# Altium project BluetoothPolive.PrjPCB
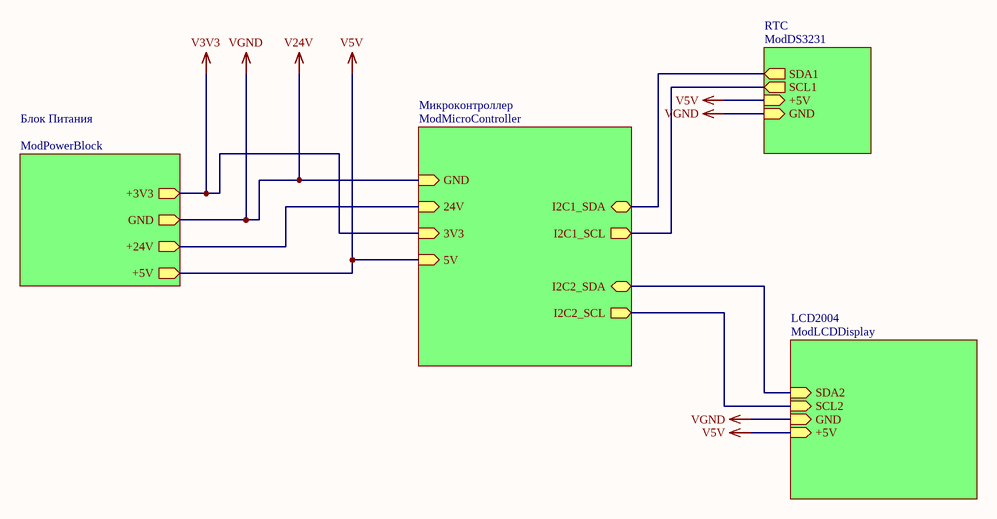
[diagram p0: Main.SchDoc]
5 sheets, 78 parts. Net scope: hierarchical (ports join the sheet entries above them; power ports are global).
Board file: PCBSystemPolive.PcbDoc
Sheets:
  Main.SchDoc
    Микроконтроллер = ModMicroController.SchDoc
    RTC = ModDS3231.SchDoc
    LCD2004 = ModLCDDisplay.SchDoc
    Блок Питания = ModPowerBlock.SchDoc

## Sheet Main.SchDoc
size 420 x 297 mm; Address1: Address1; Address2: Address2; Address3: Address3; Address4: Address4; SheetNumber: 1; Scale: 1:1; Разраб.: Иванов; Обозначение документа: АБВГ.123456.001 Э3; Пров.: Петров; Утв.: Сидоров; Наименование организации: ОАО "Концерн "МПО-Гидроприбор"; Перв. применение: АБВГ.123456.000; Наименование изделия 1: Плата; Наименование изделия 2: Схема электрическая; Наименование изделия 3: принципиальная; Нач. отд.: Нач. отд.; Фамилия нач. отд.: Сидоров

### Sub-sheets
LCD2004 = ModLCDDisplay: SDA2 (in), SCL2 (in), GND (in), +5V (in)
RTC = ModDS3231: SDA1 (out), SCL1 (out), +5V (in), GND (in)
Блок Питания = ModPowerBlock: +3V3 (out), GND (out), +24V (out), +5V (out)
Микроконтроллер = ModMicroController: GND (in), 24V (in), I2C1_SDA, I2C1_SCL (out), 3V3 (in), 5V (in), I2C2_SDA, I2C2_SCL (out)

### Nets
+24V: sheet Микроконтроллер/24V, sheet Блок Питания/+24V
V3V3: sheet Микроконтроллер/3V3, sheet Блок Питания/+3V3  [project net +3V3]
V5V: sheet Микроконтроллер/5V, sheet RTC/+5V, sheet LCD2004/+5V, sheet Блок Питания/+5V  [project net +5V]
V24V: sheet Микроконтроллер/GND, sheet RTC/GND, sheet LCD2004/GND, sheet Блок Питания/GND  [also labelled VGND]  [project net GND]
NetDD1_15: sheet Микроконтроллер/I2C1_SDA, sheet RTC/SDA1
NetDD1_16: sheet Микроконтроллер/I2C1_SCL, sheet RTC/SCL1
NetDD2_14: sheet Микроконтроллер/I2C2_SCL, sheet LCD2004/SCL2
NetDD2_15: sheet Микроконтроллер/I2C2_SDA, sheet LCD2004/SDA2

### Notes on the sheet
- Перв. примен.
- Справ. №
- Подп. и дата
- Инв. № дубл.
- Взам. инв. №
- Разраб.
- Изм.
- Лист
- № докум.
- Подп.
- Дата
- Лит.
- Масса
- Масштаб
- Пров.
- Т.контр.
- Листов
- Инв. № подл.
- Утв.
- Н.контр.
- Копировал
- Формат А3

## Sheet ModMicroController.SchDoc
size 420 x 297 mm; Address1: Address1; Address2: Address2; Address3: Address3; Address4: Address4; SheetNumber: 1; Scale: 1:1; Разраб.: Лепотенко А.С.; Обозначение документа: ЛАС.4367523.002Э3; Перв. применение: ЛАС.4367523.002; Наименование изделия 1: Контроллер управления; Наименование изделия 2: Схема электрическая; Наименование изделия 3: принципиальная; Нач. отд.: Нач. отд.
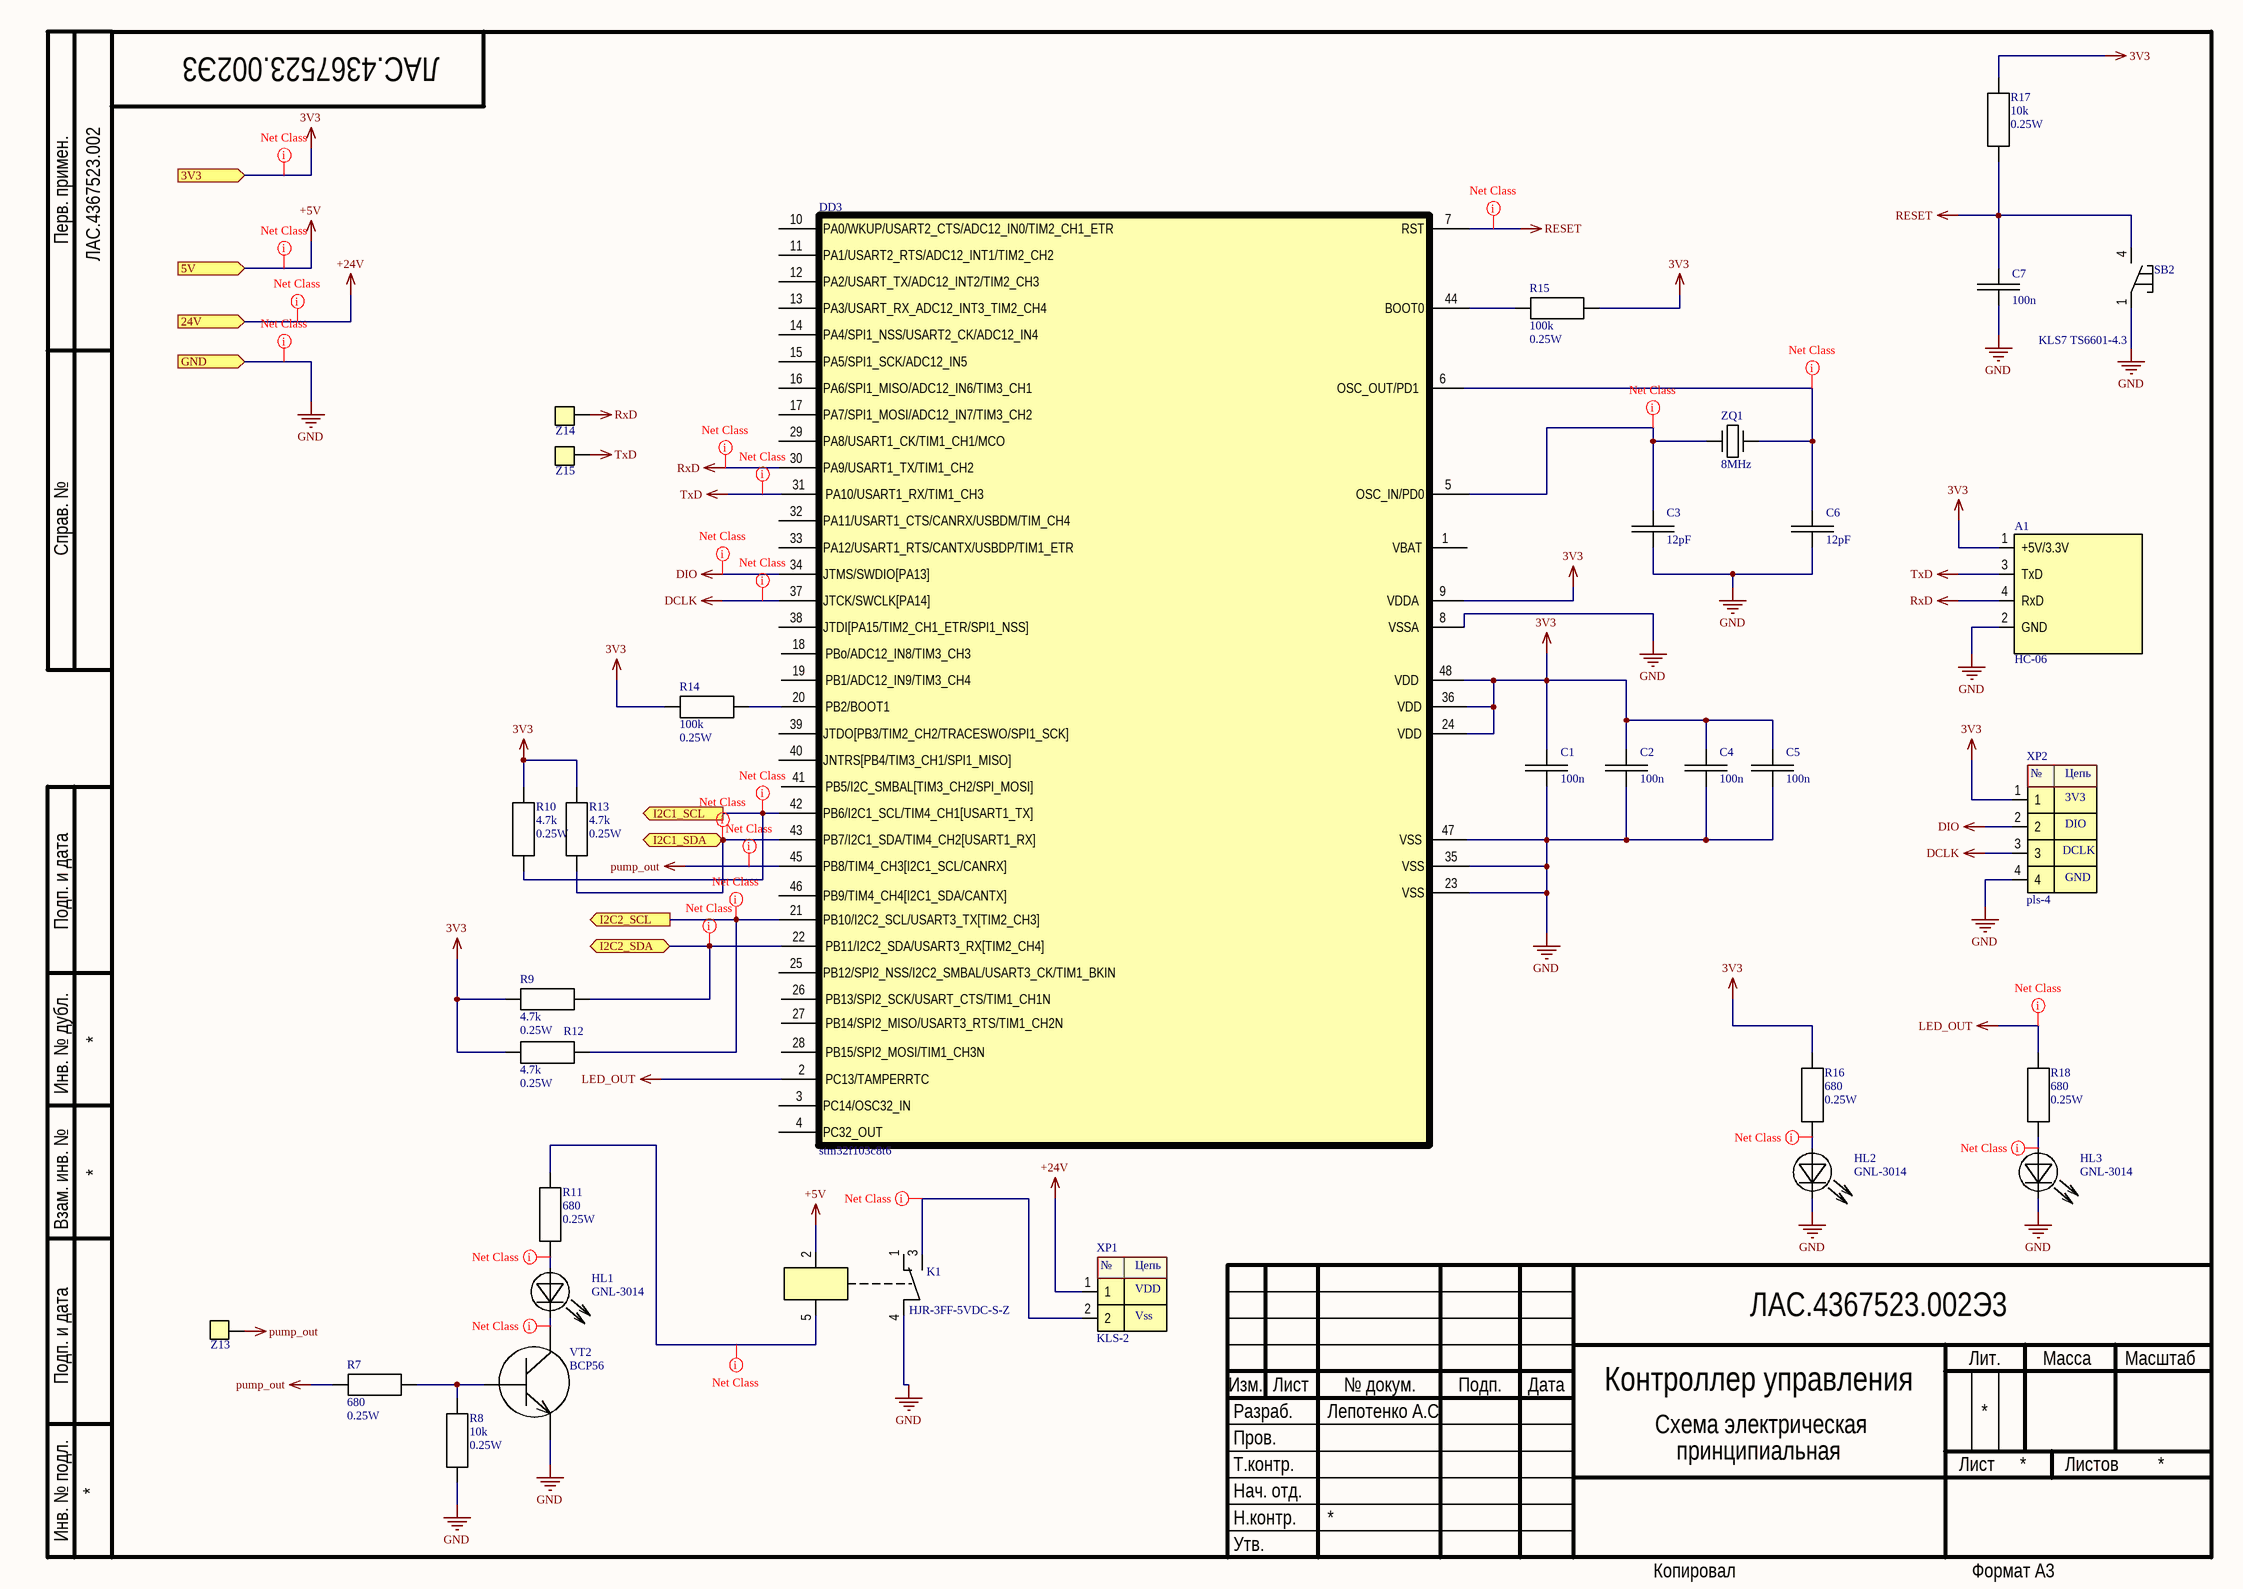
[diagram p1: ModMicroController.SchDoc]

### Parts
A1  HC-06  [HC-06]
C1  100n  [CAP1206]
C2  100n  [CAP1206]
C3  12pF  [CAP1206]
C4  100n  [CAP1206]
C5  100n  [CAP1206]
C6  12pF  [CAP1206]
C7  100n  [CAP1206]
DD3  stm32f103c8t6  [LQFP48]
HL1  GNL-3014  [GNL-3014]
HL2  GNL-3014  [GNL-3014]
HL3  GNL-3014  [GNL-3014]
K1  HJR-3FF-5VDC-S-Z  [HJR-3FF]
R7  Power: 0.25W  [1206]  (hidden comment: 680)
R8  Power: 0.25W  [1206]  (hidden comment: 10k)
R9  value 4.7k  Power: 0.25W  [1206]  (hidden comment: 4k7)
R10  value 4.7k  Power: 0.25W  [1206]  (hidden comment: 4k7)
R11  Power: 0.25W  [1206]  (hidden comment: 680)
R12  value 4.7k  Power: 0.25W  [1206]  (hidden comment: 4k7)
R13  value 4.7k  Power: 0.25W  [1206]  (hidden comment: 4k7)
R14  value 100k  Power: 0.25W  [1206]  (hidden comment: Resistor)
R15  value 100k  Power: 0.25W  [1206]  (hidden comment: Resistor)
R16  Power: 0.25W  [1206]  (hidden comment: 680)
R17  Power: 0.25W  [1206]  (hidden comment: 10k)
R18  Power: 0.25W  [1206]  (hidden comment: 680)
SB2  KLS7 TS6601-4.3  [KLS2]
VT2  BCP56  [SOT223]
XP1  KLS-2  [KLS2-EDR-500-2P]
XP2  pls-4  [Connector_STKLink]
Z13  test Point  [test Point]  (value not drawn)
Z14  test Point  [test Point]  (value not drawn)
Z15  test Point  [test Point]  (value not drawn)
ZQ1  8MHz  [HC-49US]

### Ports
3V3 (in), 5V (in), 24V (in), GND (in), I2C1_SCL (out), I2C1_SDA, I2C2_SCL (out), I2C2_SDA

### Nets
3V3: A1.1(+5V/3.3V) C1.1 C2.1 C4.1 C5.1 DD3.9(VDDA) DD3.24(VDD) DD3.36(VDD) DD3.48(VDD) R9.2 R10.2 R12.2 R13.2 R14.1 R15.2 R16.1 R17.2 XP2.1 ; port 3V3  [project net +3V3]
+5V: K1.2 ; port 5V
+24V: XP1.1 ; port 24V
DCLK: DD3.37(JTCK/SWCLK[PA14]) XP2.3
DIO: DD3.34(JTMS/SWDIO[PA13]) XP2.2
GND: A1.2(GND) C1.2 C2.2 C3.2 C4.2 C5.2 C6.2 C7.2 DD3.8(VSSA) DD3.23(VSS) DD3.35(VSS) DD3.47(VSS) HL2.2 HL3.2 K1.4 R8.1 SB2.1 VT2.3 XP2.4 ; port GND
LED_OUT: DD3.2(PC13/TAMPERRTC) R18.1
pump_out: DD3.45(PB8/TIM4_CH3[I2C1_SCL/CANRX]) R7.2 Z13.1
RESET: C7.1 DD3.7(RST) R17.1 SB2.4
RxD: A1.4(RxD) DD3.30(PA9/USART1_TX/TIM1_CH2) Z14.1
TxD: A1.3(TxD) DD3.31(PA10/USART1_RX/TIM1_CH3) Z15.1
NetC3_1: C3.1 DD3.5(OSC_IN/PD0) ZQ1.1
NetC6_1: C6.1 DD3.6(OSC_OUT/PD1) ZQ1.2
NetDD1_15: DD3.43(PB7/I2C1_SDA/TIM4_CH2[USART1_RX]) R13.1 ; port I2C1_SDA
NetDD1_16: DD3.42(PB6/I2C1_SCL/TIM4_CH1[USART1_TX]) R10.1 ; port I2C1_SCL
NetDD2_14: DD3.21(PB10/I2C2_SCL/USART3_TX[TIM2_CH3]) R12.1 ; port I2C2_SCL
NetDD2_15: DD3.22(PB11/I2C2_SDA/USART3_RX[TIM2_CH4]) R9.1 ; port I2C2_SDA
NetDD3_20: DD3.20(PB2/BOOT1) R14.2
NetDD3_44: DD3.44(BOOT0) R15.1
NetHL1_1: HL1.1 R11.1
NetHL1_2: HL1.2 VT2.2
NetHL2_1: HL2.1 R16.2
NetHL3_1: HL3.1 R18.2
NetK1_3: K1.3 XP1.2
NetK1_5: K1.5 R11.2
NetR7_1: R7.1 R8.2 VT2.1

Not connected (* = marked no-connect by the designer): DD3 1(VBAT) 3(PC14/OSC32_IN) 4(PC32_OUT) 10(PA0/WKUP/USART2_CTS/ADC12_IN0/TIM2_CH1_ETR) 11(PA1/USART2_RTS/ADC12_INT1/TIM2_CH2) 12(PA2/USART_TX/ADC12_INT2/TIM2_CH3) 13(PA3/USART_RX_ADC12_INT3_TIM2_CH4) 14(PA4/SPI1_NSS/USART2_CK/ADC12_IN4) 15(PA5/SPI1_SCK/ADC12_IN5) 16(PA6/SPI1_MISO/ADC12_IN6/TIM3_CH1) 17(PA7/SPI1_MOSI/ADC12_IN7/TIM3_CH2) 18(PBo/ADC12_IN8/TIM3_CH3) 19(PB1/ADC12_IN9/TIM3_CH4) 25(PB12/SPI2_NSS/I2C2_SMBAL/USART3_CK/TIM1_BKIN) 26(PB13/SPI2_SCK/USART_CTS/TIM1_CH1N) 27(PB14/SPI2_MISO/USART3_RTS/TIM1_CH2N) 28(PB15/SPI2_MOSI/TIM1_CH3N) 29(PA8/USART1_CK/TIM1_CH1/MCO) 32(PA11/USART1_CTS/CANRX/USBDM/TIM_CH4) 33(PA12/USART1_RTS/CANTX/USBDP/TIM1_ETR) 38(JTDI[PA15/TIM2_CH1_ETR/SPI1_NSS]) 39(JTDO[PB3/TIM2_CH2/TRACESWO/SPI1_SCK]) 40(JNTRS[PB4/TIM3_CH1/SPI1_MISO]) 41(PB5/I2C_SMBAL[TIM3_CH2/SPI_MOSI]) 46(PB9/TIM4_CH4[I2C1_SDA/CANTX]); K1 1

### Layout directives
net class DigitalNet: DCLK, DIO, LED_OUT, NetC3_1, NetC6_1, NetDD1_15, NetDD1_16, NetDD2_14, NetDD2_15, NetHL3_1, pump_out, RESET, RxD, TxD
net class Power5V_3V3: +3V3, +5V, NetHL1_1, NetHL1_2, NetHL2_1, NetK1_5
net class Power24V: +24V, GND, NetK1_3

### Notes on the sheet
- Перв. примен.
- Справ. №
- Подп. и дата
- Инв. № дубл.
- Взам. инв. №
- Разраб.
- Изм.
- Лист
- № докум.
- Подп.
- Дата
- Лит.
- Масса
- Масштаб
- Пров.
- Т.контр.
- Листов
- Инв. № подл.
- Утв.
- Н.контр.
- Копировал
- Формат А3
- (in symbol Connector_Power) №; Цепь; VDD; Vss
- (in symbol Connector_STKLink) №; Цепь; 3V3; DIO; DCLK; GND

### Library data of the parts
A1 = HC-06: Manufacturer: china; Part Number: HC-06; Price: 5; Quantity: 1; Package: none
C1 C2 C4 C5 = Capasitor: Part Number: CL31B104KBCNNNC; Manufacturer: Samsung; Value: 100nF; Voltage: 50V; Quantity: 20; Package: 1206; Price: 0.035; ShoppingPlace: http://belchip.by/product/?selected_product=31093
C3 C6 = Capasitor: Part Number: 1206120NPO; Manufacturer: Samsung; Voltage: 50V; Value: 12pF; Quantity: 20; Package: 1206; Price: 0,025; ShoppingPlace: http://belchip.by/product/?selected_product=00255
C7 = Capasitor: Value: 100n; Voltage: *; Part Number: *; Quantity: *; Package: *; Price: *; Manufacturer: *; ShoppingPlace: *
DD3 = stm32f103c8t6: Manufacturer: STM; Value: MPU; Part Number: stm32f103c8t6; Price: 4; ShoppingPlace: http://belchip.by/product/?selected_product=10603; Package: LQFP48; Quantity: 1
HL1-HL3 = LED: Part Number: GNL-3014SRD; Manufacturer: G-NOR; Value: RED; Price: 0.04; Package: GNL; Quantity: 6; Shopping Place: http://belchip.by/product/?selected_product=00813
K1 = HJR-3FF-5VDC-S-Z: Manufacturer: TIANBO; Value: 5V; Part Number: HJR-3FF-5VDC-S-Z; Price: 0.6; ShoppingPlace: http://belchip.by/product/?selected_product=00571; Quantity: 1; Package: HJR-3FF
R7 R11 R16 R18 = Resistor: Manufacturer: YAGEO; Part Number: RC1206JR-07680RL; Quntity: 4; Price: 0,15; Package: 1206; ShoppingPlace: http://belchip.by/product/?selected_product=01380; Value: 680
R8 R17 = Resistor: Manufacturer: YAGEO; Part Number: RC1206FR-0710KL; Quntity: 4; Price: 0.15; Package: 1206; ShoppingPlace: http://belchip.by/product/?selected_product=30985; Value: 10k
R9 R10 R12 R13 = Resistor: Manufacturer: YAGEO; Part Number: RC1206JR-074K7L; Quntity: 4; Price: 0,15; Package: 1206; ShoppingPlace: http://belchip.by/product/?selected_product=01399
R14 R15 = Resistor: Manufacturer: YAGEO; Part Number: RC1206JR-07100KL; Quntity: 4; Price: 0,15; Package: 1206; ShoppingPlace: http://belchip.by/product/?selected_product=31131
SB2 = Button: Manufacturer: KLS; Value: 100VDC; Part Number: KLS7 TS6601-4.3; Price: 0,04; ShoppingPlace: http://belchip.by/product/?selected_product=02682; Quantity: 6; Package: KLS2
VT2 = BCP56-16: Manufacturer: NXP Semiconductors; Part Number: BCP56-16; Price: BCP56; ShoppingPlace: http://belchip.by/product/?selected_product=12583; Quantity: 2; Package: SOT223
XP1 = Connector_Power: Part Number: KLS2-EDR; Value: 1000VAC; Package: KLS2; Quantity: 2; Price: 0,13; ShoppingPlace: http://belchip.by/product/?selected_product=03190
XP2 = Connector_STKLink: Part Number: pls-40; Manufacturer: RUICHI; Value: 24VDC; Price: 0,12; Quantity: 2; shoppingPlace: http://belchip.by/product/?selected_product=02009
ZQ1 = Rzanator: Manufacturer: GEYER; Value: 8MHz; Part Number: HC-49US; Package: HC-49US; Quantity: 1; Price: 0,255; ShoppingPlace: http://belchip.by/product/?selected_product=33253

## Sheet ModDS3231.SchDoc
size 420 x 297 mm; Address1: Address1; Address2: Address2; Address3: Address3; Address4: Address4; SheetNumber: 1; Scale: 1:1; Разраб.: Лепотенко А.С.; Обозначение документа: ЛАС.4367523.004Э3; Перв. применение: ЛАС.4367523.004; Наименование изделия 1: Блок часов RTC; Наименование изделия 2: Схема электрическая; Наименование изделия 3: принципиальная; Нач. отд.: Нач. отд.
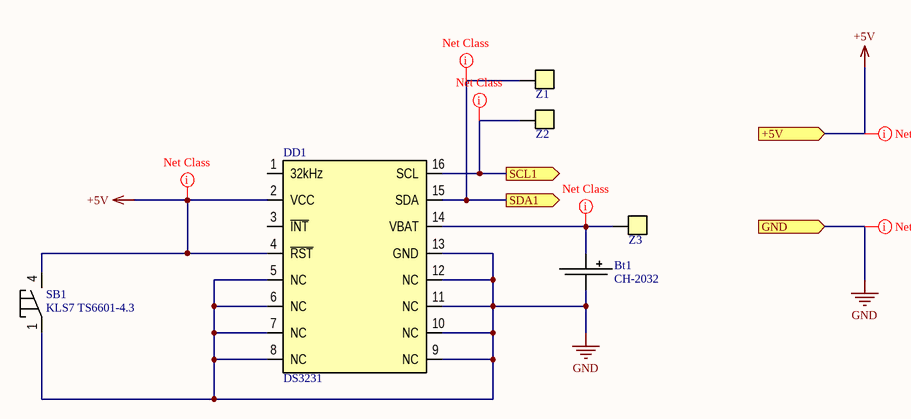
[diagram p2: ModDS3231.SchDoc]

### Parts
Bt1  CH-2032  [CH25-2032]
DD1  DS3231  [SO-16]
SB1  KLS7 TS6601-4.3  [KLS2]
Z1  test Point  [test Point]  (value not drawn)
Z2  test Point  [test Point]  (value not drawn)
Z3  test Point  [test Point]  (value not drawn)

### Ports
+5V (in), GND (in), SCL1 (out), SDA1 (out)

### Nets
+5V: DD1.2(VCC) DD1.4(~{RST}) SB1.4 ; port +5V
GND: Bt1.2 DD1.5(NC) DD1.6(NC) DD1.7(NC) DD1.8(NC) DD1.9(NC) DD1.10(NC) DD1.11(NC) DD1.12(NC) DD1.13(GND) SB1.1 ; port GND
NetBt1_1: Bt1.1 DD1.14(VBAT) Z3.1
NetDD1_15: DD1.15(SDA) Z1.1 ; port SDA1
NetDD1_16: DD1.16(SCL) Z2.1 ; port SCL1

Not connected (* = marked no-connect by the designer): DD1 1(32kHz) 3(~{INT})

### Layout directives
net class Power5V_3V3: +5V, NetBt1_1
net class DigitalNet: NetDD1_15, NetDD1_16
net class Power24V: GND

### Notes on the sheet
- Перв. примен.
- Справ. №
- Подп. и дата
- Инв. № дубл.
- Взам. инв. №
- Разраб.
- Изм.
- Лист
- № докум.
- Подп.
- Дата
- Лит.
- Масса
- Масштаб
- Пров.
- Т.контр.
- Листов
- Инв. № подл.
- Утв.
- Н.контр.
- Копировал
- Формат А3

### Library data of the parts
Bt1 = CR-2032: Manufacturer: Comf; Value: 2032; Quantity: 2; Part Number: CH25-2032; Package: CH25-2032; Price: 0.36; ShoppingPlace: http://belchip.by/product/?selected_product=12241
DD1 = DS3231: Part Number: DS3231SN; Manufacture: Maxim Integrated Products; Value: RTC; Packge: SO-16; Price: 4; Quantity: 1; ShoppingPlace: http://belchip.by/product/?selected_product=06391
SB1 = Button: Manufacturer: KLS; Value: 100VDC; Part Number: KLS7 TS6601-4.3; Price: 0,04; ShoppingPlace: http://belchip.by/product/?selected_product=02682; Quantity: 6; Package: KLS2

## Sheet ModLCDDisplay.SchDoc
size 420 x 297 mm; Address1: Address1; Address2: Address2; Address3: Address3; Address4: Address4; SheetNumber: 1; Scale: 1:1; Разраб.: Лепотенко А.С.; Обозначение документа: ЛАС.4367523.003Э3; Перв. применение: ЛАС.4367523.003; Наименование изделия 1: Блок индикации; Наименование изделия 2: Схема электрическая; Наименование изделия 3: принципиальная; Нач. отд.: Нач. отд.
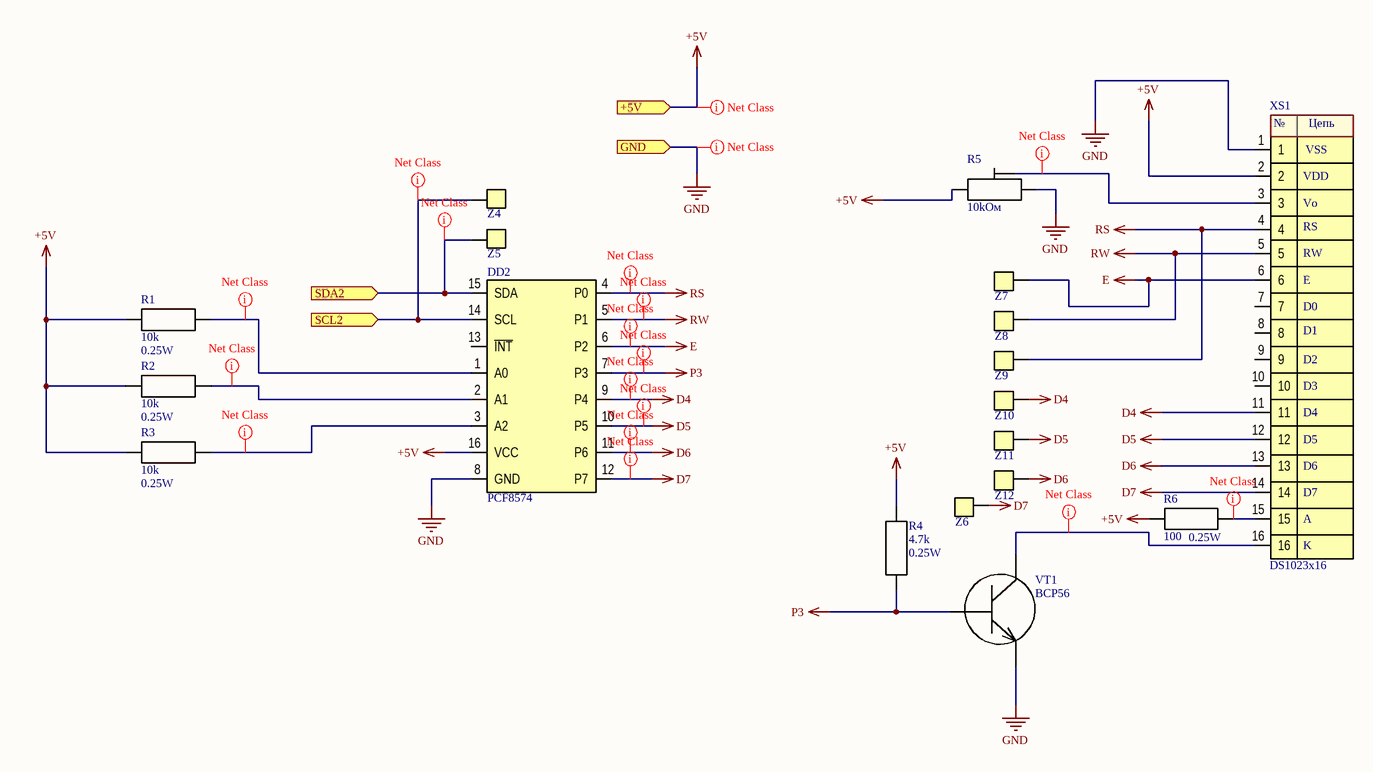
[diagram p3: ModLCDDisplay.SchDoc]

### Parts
DD2  PCF8574  [SO-16]
R1  Power: 0.25W  [1206]  (hidden comment: 10k)
R2  Power: 0.25W  [1206]  (hidden comment: 10k)
R3  Power: 0.25W  [1206]  (hidden comment: 10k)
R4  value 4.7k  Power: 0.25W  [1206]  (hidden comment: 4k7)
R5  10kОм  [3006P]
R6  Power: 0.25W  [1206]  (hidden comment: 100)
VT1  BCP56  [SOT223]
XS1  DS1023x16  [DS1023-2.54x16x1]
Z4  test Point  [test Point]  (value not drawn)
Z5  test Point  [test Point]  (value not drawn)
Z6  test Point  [test Point]  (value not drawn)
Z7  test Point  [test Point]  (value not drawn)
Z8  test Point  [test Point]  (value not drawn)
Z9  test Point  [test Point]  (value not drawn)
Z10  test Point  [test Point]  (value not drawn)
Z11  test Point  [test Point]  (value not drawn)
Z12  test Point  [test Point]  (value not drawn)

### Ports
+5V (in), GND (in), SCL2 (in), SDA2 (in)

### Nets
+5V: DD2.16(VCC) R1.1 R2.1 R3.1 R4.2 R5.1 R6.1 XS1.2 ; port +5V
D4: DD2.9(P4) XS1.11 Z10.1
D5: DD2.10(P5) XS1.12 Z11.1
D6: DD2.11(P6) XS1.13 Z12.1
D7: DD2.12(P7) XS1.14 Z6.1
E: DD2.6(P2) XS1.6 Z7.1
GND: DD2.8(GND) R5.3 VT1.3 XS1.1 ; port GND
P3: DD2.7(P3) R4.1 VT1.1
RS: DD2.4(P0) XS1.4 Z9.1
RW: DD2.5(P1) XS1.5 Z8.1
NetDD2_1: DD2.1(A0) R1.2
NetDD2_2: DD2.2(A1) R2.2
NetDD2_3: DD2.3(A2) R3.2
NetDD2_14: DD2.14(SCL) Z4.1 ; port SCL2
NetDD2_15: DD2.15(SDA) Z5.1 ; port SDA2
NetR5_2: R5.2 XS1.3
NetR6_2: R6.2 XS1.15
NetVT1_2: VT1.2 XS1.16

Not connected (* = marked no-connect by the designer): DD2 13(~{INT}); XS1 7 8 9 10

### Layout directives
net class DigitalNet: D4, D5, D6, D7, E, NetDD2_14, NetDD2_15, P3, RS, RW
net class Power5V_3V3: +5V, NetDD2_1, NetDD2_2, NetDD2_3, NetR5_2, NetR6_2, NetVT1_2
net class Power24V: GND

### Notes on the sheet
- Перв. примен.
- Справ. №
- Подп. и дата
- Инв. № дубл.
- Взам. инв. №
- Разраб.
- Изм.
- Лист
- № докум.
- Подп.
- Дата
- Лит.
- Масса
- Масштаб
- Пров.
- Т.контр.
- Листов
- Инв. № подл.
- Утв.
- Н.контр.
- Копировал
- Формат А3
- (in symbol DS1023x2.54x16x1) №; Цепь; VSS; VDD; Vo; RS; RW; E; D0; D1; D2; D3; D4; D5; D6; D7; A; K

### Library data of the parts
DD2 = PCF8574: part Number: PCF8574DW; Manufacturer: Texas Instruments; Value: IC; Package: SO-16; Price: 1.585; ShoppingPlace: http://belchip.by/product/?selected_product=29967; Quantity: 3
R1-R3 = Resistor: as R8 on sheet ModMicroController; Price: 0.15; Package: 1206; ShoppingPlace: http://belchip.by/product/?selected_product=30985; Value: 10k
R4 = Resistor: as R9 on sheet ModMicroController; Price: 0,15; Package: 1206; ShoppingPlace: http://belchip.by/product/?selected_product=01399
R5 = POT: Part Number: 3006-103-Z-LF; Manufacturer: Bours; Power: 0,125W; Package: 3006; Price: 0,445; ShoppingPlace: http://belchip.by/product/?selected_product=32831; Value: 10kОм; Quantity: 1
R6 = Resistor: Manufacturer: YAGEO; Part Number: RC1206FR-07100RL; Quntity: 4; Price: 0.15; Package: 1206; ShoppingPlace: http://belchip.by/product/?selected_product=18520; Value: 100
VT1 = BCP56-16: Manufacturer: NXP Semiconductors; Part Number: BCP56-16; Price: BCP56; ShoppingPlace: http://belchip.by/product/?selected_product=12583; Quantity: 2; Package: SOT223
XS1 = DS1023x2.54x16x1: Manufacturer: Ningbo connfly electronic; Part Number: DS1023-1*16S21; Value: 500VDC; Package: DS1023; Price: 0.12; ShoppingPlace: https://www.ru-chipdip.by/product/pbs16; Quantity: 4

## Sheet ModPowerBlock.SchDoc
size 420 x 297 mm; Address1: Address1; Address2: Address2; Address3: Address3; Address4: Address4; SheetNumber: 1; Scale: 1:1; Разраб.: Лепотенко А.С.; Обозначение документа: ЛАС.4367523.001Э3; Перв. применение: ЛАС.4367523.001; Наименование изделия 1: DC-DC преобразователь; Наименование изделия 2: Схема электрическая; Наименование изделия 3: принципиальная; Нач. отд.: Нач. отд.
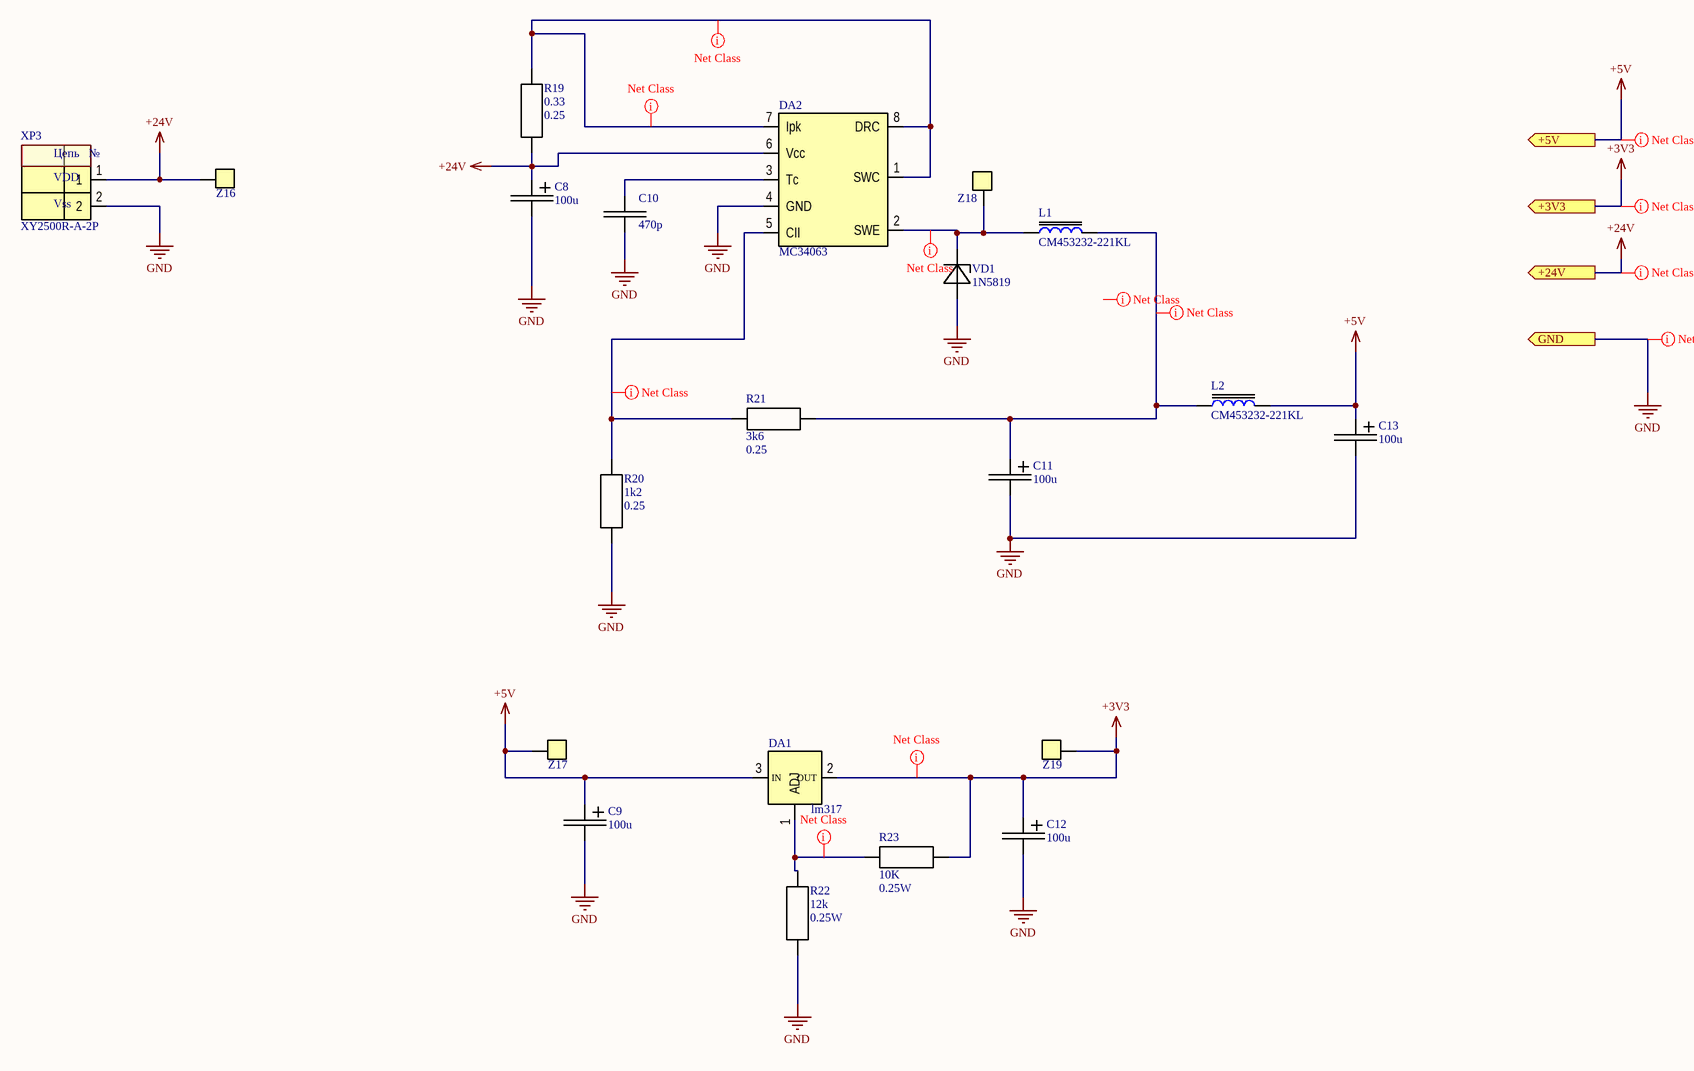
[diagram p4: ModPowerBlock.SchDoc]

### Parts
C8  100u  [CAPAE120103X105MTypeG]
C9  100u  [CAPAE120103X105MTypeG]
C10  470p  [CAP1206]
C11  100u  [CAPAE120103X105MTypeG]
C12  100u  [CAPAE120103X105MTypeG]
C13  100u  [CAPAE120103X105MTypeG]
DA1  lm317  [SOD-223]
DA2  MC34063  [SO-8]
L1  CM453232-221KL  [453232]
L2  CM453232-221KL  [453232]
R19  Power: 0.25  [1206]  (hidden comment: 0.33)
R20  Power: 0.25  [1206]  (hidden comment: 1k2)
R21  Power: 0.25  [1206]  (hidden comment: 3k6)
R22  Power: 0.25W  [1206]  (hidden comment: 12k)
R23  Power: 0.25W  [1206]  (hidden comment: 10k)
VD1  1N5819  [SOD-123]
XP3  XY2500R-A-2P  [KLS2-EDR-500-2P]
Z16  test Point  [test Point]  (value not drawn)
Z17  test Point  [test Point]  (value not drawn)
Z18  test Point  [test Point]  (value not drawn)
Z19  test Point  [test Point]  (value not drawn)

### Ports
+3V3 (out), +5V (out), +24V (out), GND (out)

### Nets
+3V3: C12.1 DA1.2(OUT) R23.2 Z19.1 ; port +3V3
+5V: C9.1 C13.1 DA1.3(IN) L2.2 Z17.1 ; port +5V
+24V: C8.1 DA2.6(Vcc) R19.1 XP3.1 Z16.1 ; port +24V
GND: C8.2 C9.2 C10.2 C11.2 C12.2 C13.2 DA2.4(GND) R20.2 R22.2 VD1.1 XP3.2 ; port GND
NetC10_1: C10.1 DA2.3(Tc)
NetC11_1: C11.1 L1.2 L2.1 R21.2
NetDA1_1: DA1.1(ADJ) R22.1 R23.1
NetDA2_1: DA2.1(SWC) DA2.7(Ipk) DA2.8(DRC) R19.2
NetDA2_2: DA2.2(SWE) L1.1 VD1.2 Z18.1
NetDA2_5: DA2.5(CII) R20.1 R21.1

### Layout directives
net class Power5V_3V3: (no net found under the mark), +3V3, +5V, NetC11_1, NetDA1_1, NetDA2_2, NetDA2_5
net class Power24V: +24V, GND, NetDA2_1

### Notes on the sheet
- Перв. примен.
- Справ. №
- Подп. и дата
- Инв. № дубл.
- Взам. инв. №
- Разраб.
- Изм.
- Лист
- № докум.
- Подп.
- Дата
- Лит.
- Масса
- Масштаб
- Пров.
- Т.контр.
- Листов
- Инв. № подл.
- Утв.
- Н.контр.
- Копировал
- Формат А3
- (in symbol Connector_Power) Цепь; №; VDD; Vss

### Library data of the parts
C8 C9 C11-C13 = Capasitor Electrolit: Part Namber: RC1H107M08010VR; Manufacturer: Samwha; Value: 100uF; Power: 50V; Price: 0.23; ShoppingPlace: http://belchip.by/product/?selected_product=12709; Package: TypeG
C10 = Capasitor: Part Number: 1206471X7R; Manufacturer: FAITHFULL LINK; Voltage: 50V; Value: 470p; Quantity: 4; Package: 1206; Price: 0.02; ShoppingPlace: http://belchip.by/product/?selected_product=00281
DA1 = lm317: Manufacturer: Texas Instruments; Part Number: LM317AEMP/NOPB; Value: 1.5A; Package: SOT-223; Quantity: 1; Price: 2.5; ShoppingPlace: http://belchip.by/product/?selected_product=11445
DA2 = MC34063: part Number: MC34063ADR; Manufacturer: ON Semiconductor; Value: *; Package: SO-8; Price: 0,3; ShoppingPlace: http://belchip.by/product/?selected_product=28823; Quantity: 4
L1 L2 = CM453232-221KL: Manufacturer: Bourns; Value: 220u; Part Number: CM453232-221KL; ShoppingPlace: https://www.ru-chipdip.by/product/cm453232-221kl; Price: 0.225; Package: 1812; Quantity: 2
R19 = Resistor: Manufacturer: Royal Ohm; Part Number: 1206R033; Quntity: 3; Price: 0.5; Package: 1206; ShoppingPlace: http://belchip.by/product/?selected_product=32979; Value: 0.33
R20 = Resistor: Manufacturer: Royal Ohm; Part Number: 1206R122; Quntity: 3; Price: 0.5; Package: 1206; ShoppingPlace: http://belchip.by/product/?selected_product=01386; Value: 1k2
R21 = Resistor: Manufacturer: Royal Ohm; Part Number: 1206R362; Quntity: 3; Price: 0.5; Package: 1206; ShoppingPlace: http://belchip.by/product/?selected_product=01396; Value: 3k6
R22 R23 = Resistor: Manufacturer: YAGEO; Part Number: RC1206FR-0710KL; Quntity: 3; Price: 0.15; Package: 1206
  R22: ShoppingPlace: http://belchip.by/product/?selected_product=01409; Value: 12k
  R23: ShoppingPlace: http://belchip.by/product/?selected_product=30985; Value: 10K
VD1 = 1N5819: Manufacturer: GALAXY; Value: 40V; Power: 1A; Price: 0.12; ShoppingPlace: http://belchip.by/product/?selected_product=08853; Package: SOD-123; Quantity: 3
XP3 = Connector_Power: Value: 500VDC; Package: XY2500R; Part Number: XY2500R-A-2P; Quantity: 1; Price: 0,10; ShoppingPlace: http://belchip.by/product/?selected_product=14514

## Nets that join several sheets
+3V3: ModMicroController (18 pins), ModPowerBlock (C12.1 DA1.2 R23.2 Z19.1)
+5V: ModMicroController (K1.2), ModDS3231 (DD1.2 DD1.4 SB1.4), ModLCDDisplay (8 pins), ModPowerBlock (5 pins)
+24V: ModMicroController (XP1.1), ModPowerBlock (5 pins)
GND: ModMicroController (19 pins), ModDS3231 (11 pins), ModLCDDisplay (DD2.8 R5.3 VT1.3 XS1.1), ModPowerBlock (11 pins)
NetDD1_15: ModMicroController (DD3.43 R13.1), ModDS3231 (DD1.15 Z1.1)
NetDD1_16: ModMicroController (DD3.42 R10.1), ModDS3231 (DD1.16 Z2.1)
NetDD2_14: ModMicroController (DD3.21 R12.1), ModLCDDisplay (DD2.14 Z4.1)
NetDD2_15: ModMicroController (DD3.22 R9.1), ModLCDDisplay (DD2.15 Z5.1)